# Altium schematic sheet revisies.SchDoc
size A3; DrawnBy: CdB; Engineer: CdB; Organization: Ultimaker B.V.; DocumentNumber: 6; Revision: 1548-I; SheetNumber: 6; SheetTotal: 6
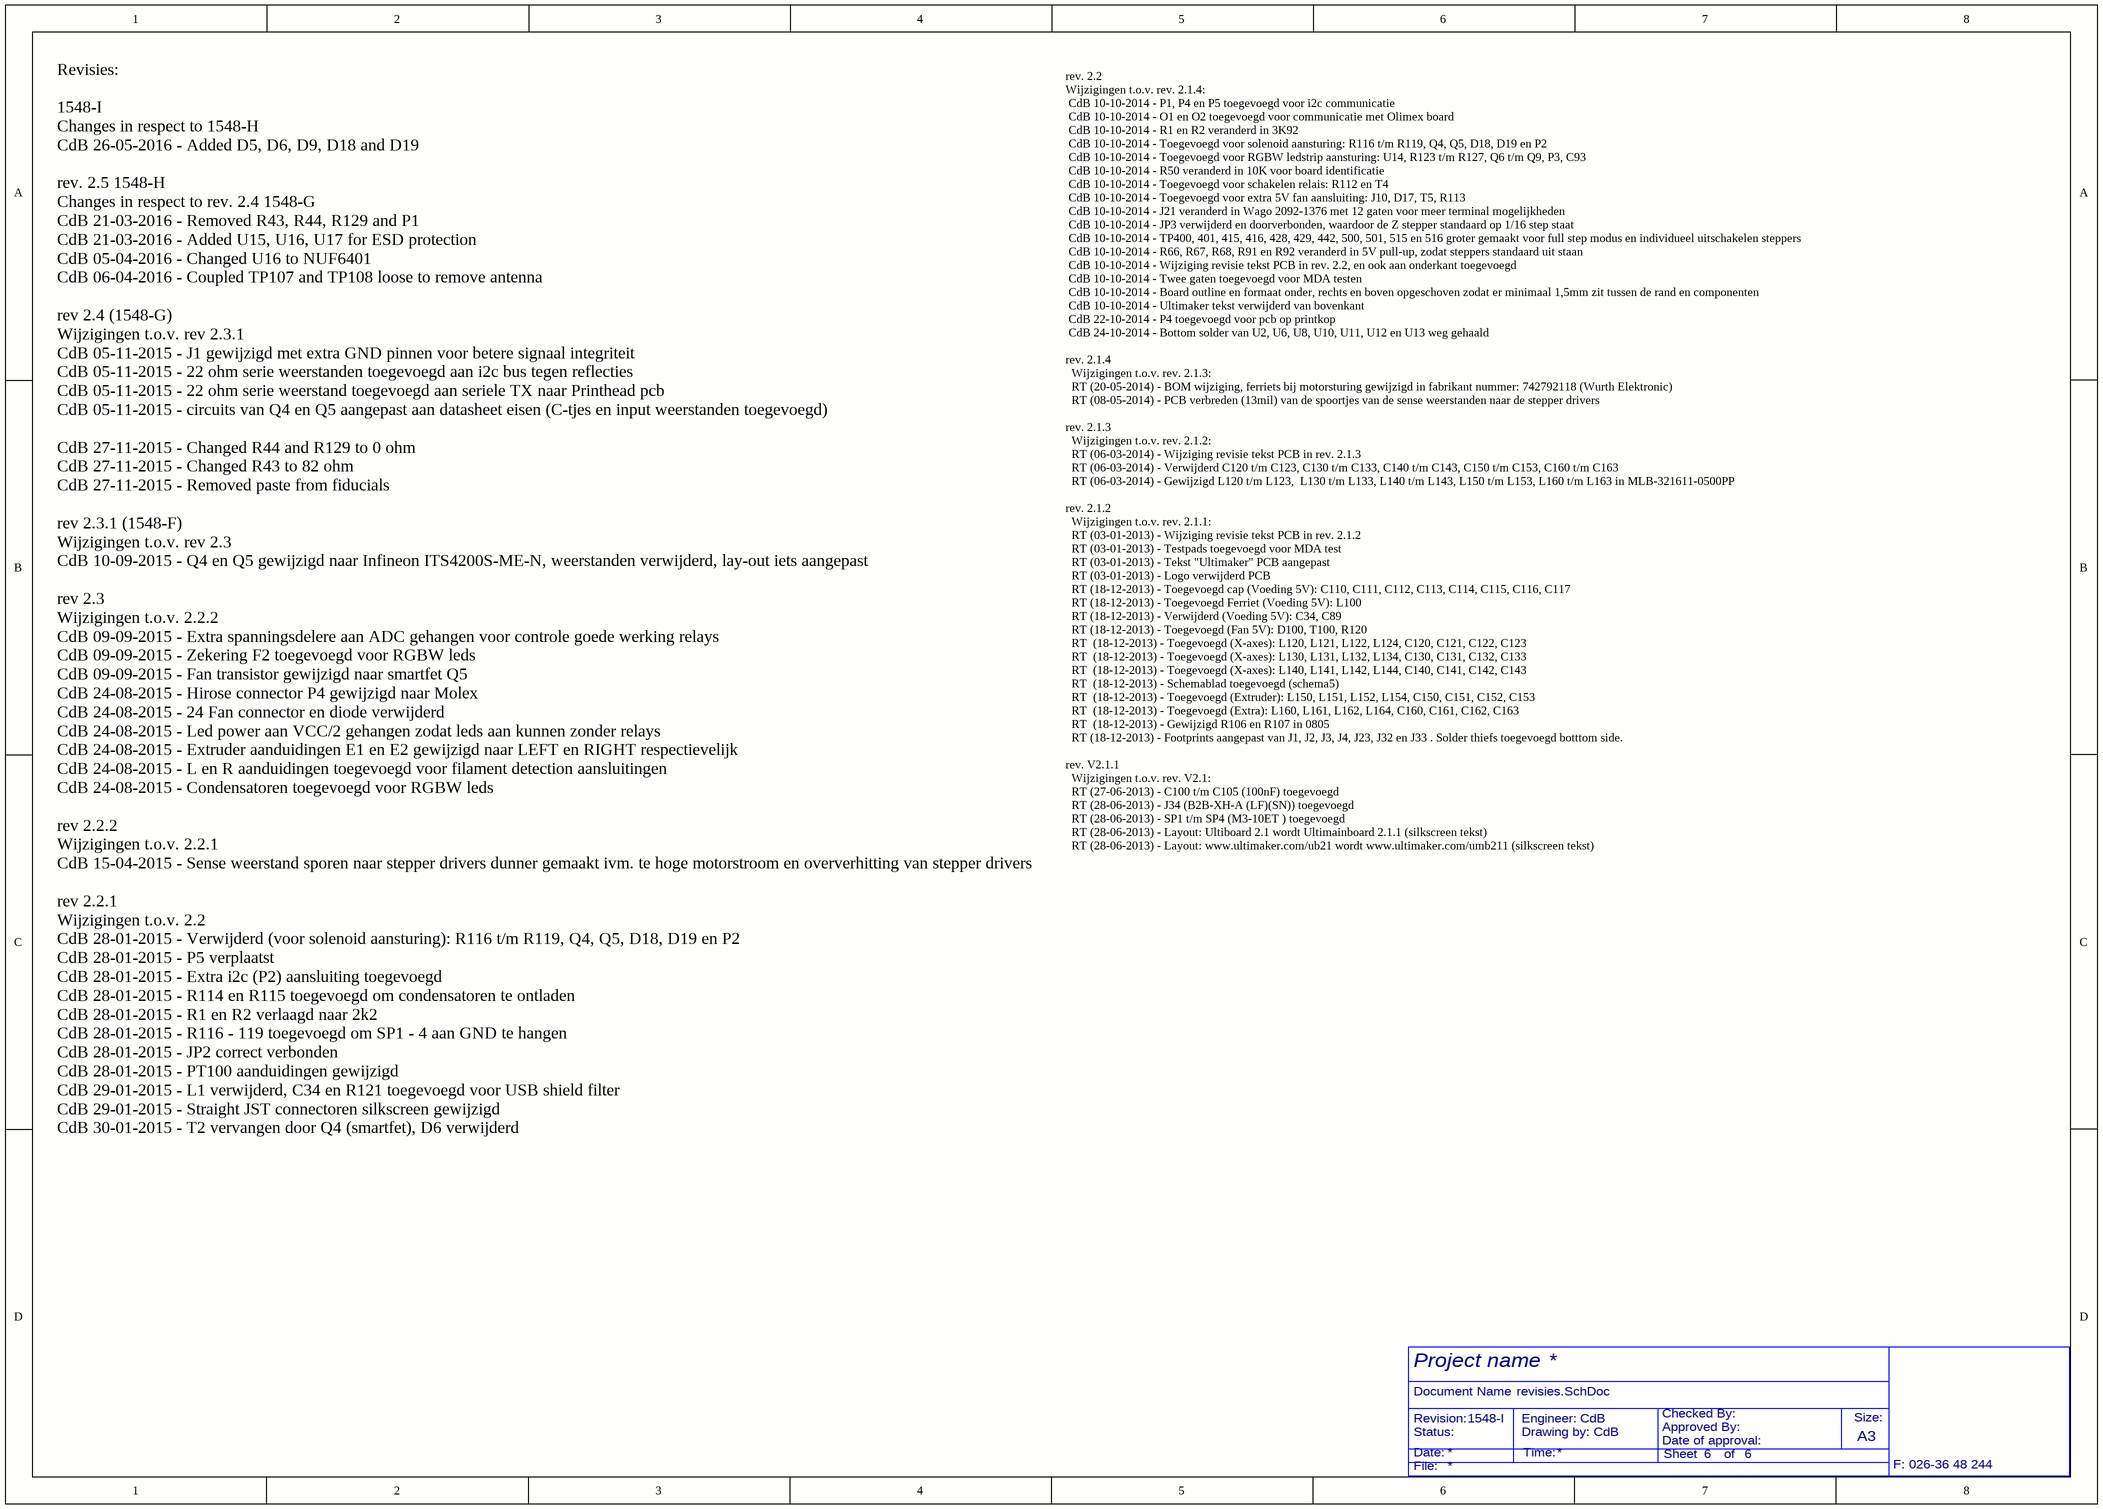
[diagram p0: revisies.SchDoc]

## Notes on the sheet
- Revisies:
  1548-I
  Changes in respect to 1548-H
  CdB 26-05-2016 - Added D5, D6, D9, D18 and D19
  rev. 2.5 1548-H
  Changes in respect to rev. 2.4 1548-G
  CdB 21-03-2016 - Removed R43, R44, R129 and P1
  CdB 21-03-2016 - Added U15, U16, U17 for ESD protection
  CdB 05-04-2016 - Changed U16 to NUF6401
  CdB 06-04-2016 - Coupled TP107 and TP108 loose to remove antenna
  rev 2.4 (1548-G)
  Wijzigingen t.o.v. rev 2.3.1
  CdB 05-11-2015 - J1 gewijzigd met extra GND pinnen voor betere signaal integriteit
  CdB 05-11-2015 - 22 ohm serie weerstanden toegevoegd aan i2c bus tegen reflecties
  CdB 05-11-2015 - 22 ohm serie weerstand toegevoegd aan seriele TX naar Printhead pcb
  CdB 05-11-2015 - circuits van Q4 en Q5 aangepast aan datasheet eisen (C-tjes en input weerstanden toegevoegd)
  CdB 27-11-2015 - Changed R44 and R129 to 0 ohm
  CdB 27-11-2015 - Changed R43 to 82 ohm
  CdB 27-11-2015 - Removed paste from fiducials
  rev 2.3.1 (1548-F)
  Wijzigingen t.o.v. rev 2.3
  CdB 10-09-2015 - Q4 en Q5 gewijzigd naar Infineon ITS4200S-ME-N, weerstanden verwijderd, lay-out iets aangepast
  rev 2.3
  Wijzigingen t.o.v. 2.2.2
  CdB 09-09-2015 - Extra spanningsdelere aan ADC gehangen voor controle goede werking relays
  CdB 09-09-2015 - Zekering F2 toegevoegd voor RGBW leds
  CdB 09-09-2015 - Fan transistor gewijzigd naar smartfet Q5
  CdB 24-08-2015 - Hirose connector P4 gewijzigd naar Molex
  CdB 24-08-2015 - 24 Fan connector en diode verwijderd
  CdB 24-08-2015 - Led power aan VCC/2 gehangen zodat leds aan kunnen zonder relays
  CdB 24-08-2015 - Extruder aanduidingen E1 en E2 gewijzigd naar LEFT en RIGHT respectievelijk
  CdB 24-08-2015 - L en R aanduidingen toegevoegd voor filament detection aansluitingen
  CdB 24-08-2015 - Condensatoren toegevoegd voor RGBW leds
  rev 2.2.2
  Wijzigingen t.o.v. 2.2.1
  CdB 15-04-2015 - Sense weerstand sporen naar stepper drivers dunner gemaakt ivm. te hoge motorstroom en oververhitting van stepper drivers
  rev 2.2.1
  Wijzigingen t.o.v. 2.2
  CdB 28-01-2015 - Verwijderd (voor solenoid aansturing): R116 t/m R119, Q4, Q5, D18, D19 en P2
  CdB 28-01-2015 - P5 verplaatst
  CdB 28-01-2015 - Extra i2c (P2) aansluiting toegevoegd
  CdB 28-01-2015 - R114 en R115 toegevoegd om condensatoren te ontladen
  CdB 28-01-2015 - R1 en R2 verlaagd naar 2k2
  CdB 28-01-2015 - R116 - 119 toegevoegd om SP1 - 4 aan GND te hangen
  CdB 28-01-2015 - JP2 correct verbonden
  CdB 28-01-2015 - PT100 aanduidingen gewijzigd
  CdB 29-01-2015 - L1 verwijderd, C34 en R121 toegevoegd voor USB shield filter
  CdB 29-01-2015 - Straight JST connectoren silkscreen gewijzigd
  CdB 30-01-2015 - T2 vervangen door Q4 (smartfet), D6 verwijderd
- rev. 2.2
  Wijzigingen t.o.v. rev. 2.1.4:
  CdB 10-10-2014 - P1, P4 en P5 toegevoegd voor i2c communicatie
  CdB 10-10-2014 - O1 en O2 toegevoegd voor communicatie met Olimex board
  CdB 10-10-2014 - R1 en R2 veranderd in 3K92
  CdB 10-10-2014 - Toegevoegd voor solenoid aansturing: R116 t/m R119, Q4, Q5, D18, D19 en P2
  CdB 10-10-2014 - Toegevoegd voor RGBW ledstrip aansturing: U14, R123 t/m R127, Q6 t/m Q9, P3, C93
  CdB 10-10-2014 - R50 veranderd in 10K voor board identificatie
  CdB 10-10-2014 - Toegevoegd voor schakelen relais: R112 en T4
  CdB 10-10-2014 - Toegevoegd voor extra 5V fan aansluiting: J10, D17, T5, R113
  CdB 10-10-2014 - J21 veranderd in Wago 2092-1376 met 12 gaten voor meer terminal mogelijkheden
  CdB 10-10-2014 - JP3 verwijderd en doorverbonden, waardoor de Z stepper standaard op 1/16 step staat
  CdB 10-10-2014 - TP400, 401, 415, 416, 428, 429, 442, 500, 501, 515 en 516 groter gemaakt voor full step modus en individueel uitschakelen steppers
  CdB 10-10-2014 - R66, R67, R68, R91 en R92 veranderd in 5V pull-up, zodat steppers standaard uit staan
  CdB 10-10-2014 - Wijziging revisie tekst PCB in rev. 2.2, en ook aan onderkant toegevoegd
  CdB 10-10-2014 - Twee gaten toegevoegd voor MDA testen
  CdB 10-10-2014 - Board outline en formaat onder, rechts en boven opgeschoven zodat er minimaal 1,5mm zit tussen de rand en componenten
  CdB 10-10-2014 - Ultimaker tekst verwijderd van bovenkant
  CdB 22-10-2014 - P4 toegevoegd voor pcb op printkop
  CdB 24-10-2014 - Bottom solder van U2, U6, U8, U10, U11, U12 en U13 weg gehaald
  rev. 2.1.4
  Wijzigingen t.o.v. rev. 2.1.3:
  RT (20-05-2014) - BOM wijziging, ferriets bij motorsturing gewijzigd in fabrikant nummer: 742792118 (Wurth Elektronic)
  RT (08-05-2014) - PCB verbreden (13mil) van de spoortjes van de sense weerstanden naar de stepper drivers
  rev. 2.1.3
  Wijzigingen t.o.v. rev. 2.1.2:
  RT (06-03-2014) - Wijziging revisie tekst PCB in rev. 2.1.3
  RT (06-03-2014) - Verwijderd C120 t/m C123, C130 t/m C133, C140 t/m C143, C150 t/m C153, C160 t/m C163
  RT (06-03-2014) - Gewijzigd L120 t/m L123,  L130 t/m L133, L140 t/m L143, L150 t/m L153, L160 t/m L163 in MLB-321611-0500PP
  rev. 2.1.2
  Wijzigingen t.o.v. rev. 2.1.1:
  RT (03-01-2013) - Wijziging revisie tekst PCB in rev. 2.1.2
  RT (03-01-2013) - Testpads toegevoegd voor MDA test
  RT (03-01-2013) - Tekst "Ultimaker" PCB aangepast
  RT (03-01-2013) - Logo verwijderd PCB
  RT (18-12-2013) - Toegevoegd cap (Voeding 5V): C110, C111, C112, C113, C114, C115, C116, C117
  RT (18-12-2013) - Toegevoegd Ferriet (Voeding 5V): L100
  RT (18-12-2013) - Verwijderd (Voeding 5V): C34, C89
  RT (18-12-2013) - Toegevoegd (Fan 5V): D100, T100, R120
  RT  (18-12-2013) - Toegevoegd (X-axes): L120, L121, L122, L124, C120, C121, C122, C123
  RT  (18-12-2013) - Toegevoegd (X-axes): L130, L131, L132, L134, C130, C131, C132, C133
  RT  (18-12-2013) - Toegevoegd (X-axes): L140, L141, L142, L144, C140, C141, C142, C143
  RT  (18-12-2013) - Schemablad toegevoegd (schema5)
  RT  (18-12-2013) - Toegevoegd (Extruder): L150, L151, L152, L154, C150, C151, C152, C153
  RT  (18-12-2013) - Toegevoegd (Extra): L160, L161, L162, L164, C160, C161, C162, C163
  RT  (18-12-2013) - Gewijzigd R106 en R107 in 0805
  RT (18-12-2013) - Footprints aangepast van J1, J2, J3, J4, J23, J32 en J33 . Solder thiefs toegevoegd botttom side.
  rev. V2.1.1
  Wijzigingen t.o.v. rev. V2.1:
  RT (27-06-2013) - C100 t/m C105 (100nF) toegevoegd
  RT (28-06-2013) - J34 (B2B-XH-A (LF)(SN)) toegevoegd
  RT (28-06-2013) - SP1 t/m SP4 (M3-10ET ) toegevoegd
  RT (28-06-2013) - Layout: Ultiboard 2.1 wordt Ultimainboard 2.1.1 (silkscreen tekst)
  RT (28-06-2013) - Layout: www.ultimaker.com/ub21 wordt www.ultimaker.com/umb211 (silkscreen tekst)
- Project name
- Document Name
- Revision:
- Date:
- Status:
- Engineer:
- Drawing by:
- Time:
- Approved By:
- Checked By:
- Date of approval:
- Sheet
- of
- Size:
- A3
- File:
- F: 026-36 48 244